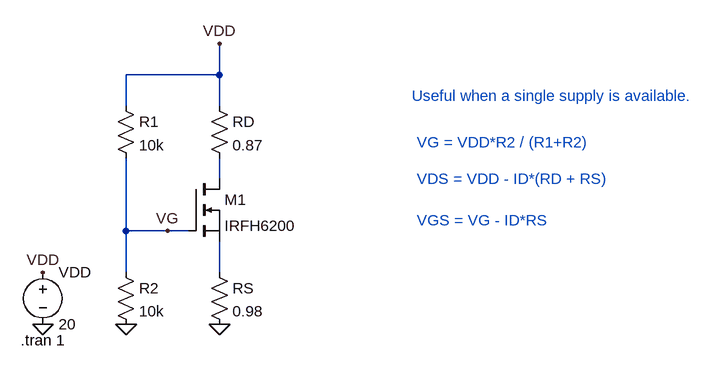
[diagram p0: schematic MOSFET Voltage Divider Bias.asc]
MOSFET Voltage Divider Bias.asc, the LTspice schematic file:
Version 4
SHEET 1 960 680
WIRE 192 -48 192 -96
WIRE 192 -48 48 -48
WIRE 48 0 48 -48
WIRE 192 0 192 -48
WIRE 192 112 192 80
WIRE 48 192 48 80
WIRE 112 192 48 192
WIRE 144 192 112 192
WIRE 48 256 48 192
WIRE 192 256 192 208
FLAG -80 336 0
FLAG -80 256 VDD
FLAG 192 -96 VDD
FLAG 192 336 0
FLAG 48 336 0
FLAG 112 192 VG
SYMBOL nmos 144 112 R0
SYMATTR InstName M1
SYMATTR Value IRFH6200
SYMBOL res 176 -16 R0
SYMATTR InstName RD
SYMATTR Value 0.87
SYMBOL res 176 240 R0
SYMATTR InstName RS
SYMATTR Value 0.98
SYMBOL res 32 -16 R0
SYMATTR InstName R1
SYMATTR Value 10k
SYMBOL res 32 240 R0
SYMATTR InstName R2
SYMATTR Value 10k
SYMBOL voltage -80 240 R0
WINDOW 123 0 0 Left 0
WINDOW 39 0 0 Left 0
SYMATTR InstName VDD
SYMATTR Value 20
TEXT -114 360 Left 2 !.tran 1
TEXT 488 -16 Left 2 ;Useful when a single supply is available.
TEXT 496 56 Left 2 ;VG = VDD*R2 / (R1+R2)
TEXT 496 112 Left 2 ;VDS = VDD - ID*(RD + RS)
TEXT 496 176 Left 2 ;VGS = VG - ID*RS

The netlist it stands for:
* MOSFET Voltage Divider Bias.asc
M1 N001 VG N002 N002 IRFH6200
RD VDD N001 0.87
RS N002 0 0.98
R1 VDD VG 10k
R2 VG 0 10k
VDD VDD 0 20
.model NMOS NMOS
.model PMOS PMOS
.lib standard.mos
.tran 1
* Useful when a single supply is available.
* VG = VDD*R2 / (R1+R2)
* VDS = VDD - ID*(RD + RS)
* VGS = VG - ID*RS
.backanno
.end